# Altium project ana.PrjPcb
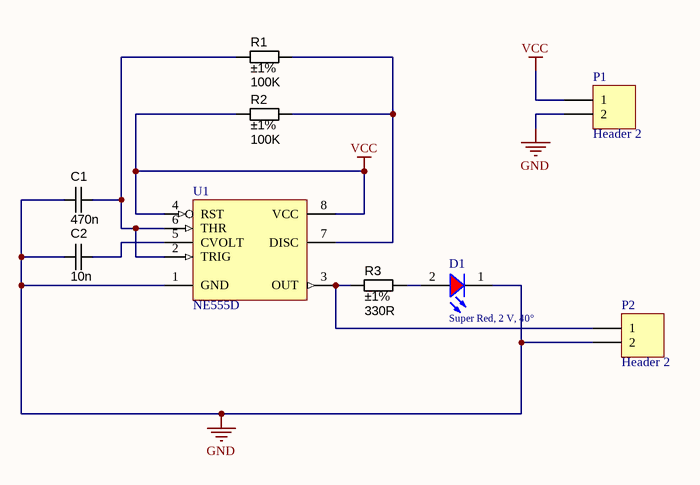
[diagram p0: Sheet1.SchDoc]
1 sheet, 9 parts. Net scope: global (net labels, ports and power ports of the same name join across sheets).
Board file: PCB1.PcbDoc

## Sheet Sheet1.SchDoc
size A4

### Parts
C1  value 470n  [CAPC2012X135N]  (hidden comment: approved sub OK)
C2  value 10n  [CAPC2012X135N]  (hidden comment: approved sub OK)
D1  Super Red, 2 V, 40°  [WL-TMRC_3 mm_without stopper]
P1  Header 2  [HDR1X2]
P2  Header 2  [HDR1X2]
R1  value 100K  Tolerance: ±1%  [RESC2012X70N]  (hidden comment: Thick Film)
R2  value 100K  Tolerance: ±1%  [RESC2012X70N]  (hidden comment: Thick Film)
R3  value 330R  Tolerance: ±1%  [RESC2012X70N]  (hidden comment: Thick Film)
U1  NE555D  [D008_N]

### Nets
GND: C1.1 C2.1 D1.1(K) P1.2 P2.2 U1.1(GND)
VCC: P1.1 R2.1 U1.4(RST) U1.8(VCC)
NetC1_2: C1.2 R1.1 U1.2(TRIG) U1.6(THR)
NetC2_2: C2.2 U1.5(CVOLT)
NetD1_2: D1.2(A) R3.2
NetP2_1: P2.1 R3.1 U1.3(OUT)
NetR1_2: R1.2 R2.2 U1.7(DISC)

### Library data of the parts
C1 C2 = CAPC_10u_0805_10V: Capacitor SMD Cer 10uF 10% 10V X5R 0805; Manufacturer 1: AVX Corporation; Manufacturer Part Number 1: 0805ZD106KAT2A; Ratings: 10V; X5R; Material: ceramic; SCDType: spec; Package / Case: 0805 (2012 metric); Tolerance: ±10%; Manufacturer 2: Kemet; Manufacturer Part Number 2: C0805C106K8PACTU; Supplier 1: Digi-Key; Supplier Part Number 1: 478-5167-1-ND; ComponentLink1URL: http://www.avx.com/docs/Catalogs/cx5r.pdf; ComponentLink1Description: http://www.avx.com/docs/Catalogs/cx5r.pdf; ComponentLink2URL: http://www.kemet.com/datasheets&C0805C106K8PACTU; ComponentLink2Description: http://www.kemet.com/datasheets&C0805C106K8PACTU; Supplier 2: Digi-Key; Supplier Part Number 2: 399-4925-1-ND
D1 = 151031SS04000: WL-TMRC THT Mono-color Round Color, 3 mm, without stopper, Super Red, 40°, 2 V; Forward Voltage: 2 V; Peak Wavelength: 640 nm; Dominant Wavelength: 635 nm; Luminous Intensity: 160 mcd; ComponentLink1Description: Manufacturer; ComponentLink1URL: http://www.we-online.de; ComponentLink2Description: Datasheet; ComponentLink2URL: http://katalog.we-online.de/led/datasheet/151031SS04000.pdf; Part Number: 151031SS04000; Published Date: March 2018; Publisher: Wurth Elektronik; Size: 3 mm, without stopper; Viewing Angle: 40°; Operating Temperature: -40 to 85 degC; Emitting Color: Super Red
P1 P2 = Header 2: Header, 2-Pin; LatestRevisionDate: 17-Jul-2002; LatestRevisionNote: Re-released for DXP Platform.; Publisher: Altium Limited
R1 = RES_10K_0805_1%: Resistor SMD chip 10k Ohm 0.125W 1% 0805; Manufacturer 1: Vishay/Dale; Manufacturer Part Number 1: CRCW080510K0FKEA; Ratings: 1/8W; SCDType: spec; Package / Case: 0805 (2012 metric); Supplier 1: Digi-Key; Supplier Part Number 1: 541-10.0KCCT-ND; Material: Thick Film
R2 R3 = RES_1K_0805_1%: Resistor SMD chip 1k Ohm 0.125W 1% 0805; Manufacturer 1: Vishay/Dale; Manufacturer Part Number 1: CRCW08051K00FKEA; Ratings: 1/8W; SCDType: spec; Supplier 1: Digi-Key; Supplier Part Number 1: 541-1.00KCCT-ND; Package / Case: 0805 (2012 metric)
U1 = NE555D: Precision Timer; Published: 16-Jan-2001; LatestRevisionDate: 13-Apr-2006; LatestRevisionNote: IPC-7351 Footprint Added.; DatasheetVersion: Feb-1992; PackageVersion: Jan-1998; PackageReference: D008; Publisher: Altium Limited; PackageDescription: 8-Pin Small Outline Integrated Circuit 1.27 mm Pitch; Code_IPC: SOIC127P600-8; ComponentLink1Description: Manufacturer Link; ComponentLink1URL: http://www.ti.com/; ComponentLink2Description: Datasheet; ComponentLink2URL: http://www-s.ti.com/sc/ds/ne555.pdf